# Altium schematic sheet POWER_GATEWAY.SchDoc
size A4
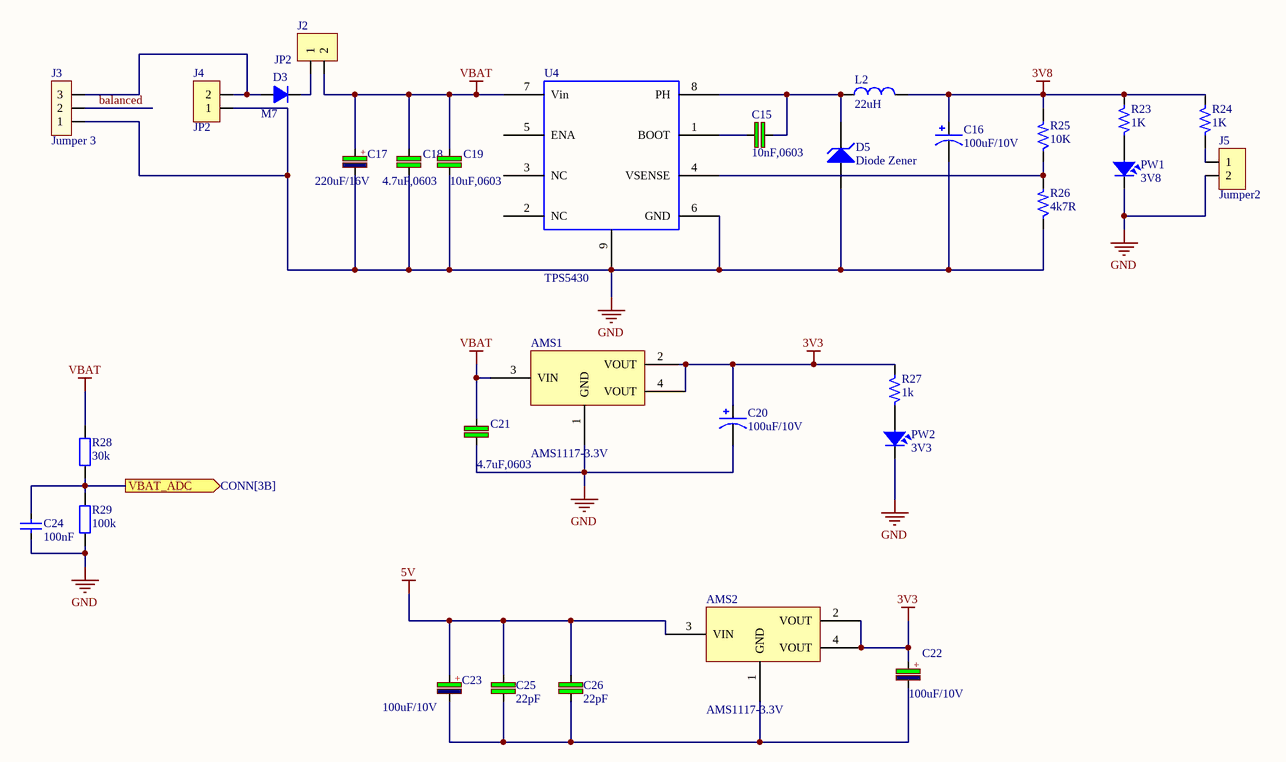
[diagram p0: POWER_GATEWAY.SchDoc]

## Parts
AMS1  AMS1117-3.3V  [SOT223]
AMS2  AMS1117-3.3V  [SOT223]
C15  value 10nF,0603  [CAP_0603]  (hidden comment: 100nF)
C16  100uF/10V  [CAP-ALU-SMD-C]
C17  220uF/16V  [CAP-ALU-SMD-D]
C18  value 4.7uF,0603  [CAP_0603]  (hidden comment: 100nF)
C19  value 10uF,0603  [CAP_0603]  (hidden comment: 100uF)
C20  100uF/10V  [CAP-ALU-SMD-C]
C21  value 4.7uF,0603  [CAP_0603]  (hidden comment: 33pF)
C22  100uF/10V  [CAP-ALU-SMD-C]
C23  100uF/10V  [CAP-ALU-SMD-C]
C24  100nF  [CAP_0805]
C25  22pF  [CAP_0603]
C26  22pF  [CAP_0603]
D3  M7  [SMA]
D5  Diode Zener  [SMA]
J2  JP2  [KF2-5.08]
J3  Jumper 3  [KF3-5.08]
J4  JP2  [KF2-5.08]
J5  Jumper2  [CON2]
L2  22uH  [L-SMD-M-7.3x4.5]
PW1  3V8  [LED-0805-Blue]
PW2  3V3  [LED-0805-Blue]
R23  1K  [RES-SMD-0805]
R24  1K  [RES-SMD-0805]
R25  10K  [RES-SMD-0603]
R26  4k7R  [RES-SMD-0603]
R27  1k  [RES-SMD-0603]
R28  30k  [RES-SMD-0805]
R29  100k  [RES-SMD-0805]
U4  TPS5430  [TPS5430-2]

## Ports
VBAT_ADC (out, see CONN[3B])

## Nets
3V3: AMS1.2(VOUT) AMS1.4(VOUT) AMS2.2(VOUT) AMS2.4(VOUT) C20.1 C22.1 R27.1
3V8: C16.1 L2.2 R23.1 R24.1 R25.2
5V: AMS2.3(VIN) C23.1 C25.1 C26.1
GND: AMS1.1(GND) C16.2 C17.2 C18.1 C19.1 C20.2 C21.1 C24.1 D5.1(A) J3.1 J4.1 J5.2 PW1.2 PW2.2 R26.1 R29.1 U4.6(GND) U4.9(PWR_PAD)
VBAT: AMS1.3(VIN) C17.1 C18.2 C19.2 C21.2 J2.2 R28.2 U4.7(Vin)
balanced: J3.2
VBAT_ADC: C24.2 R28.1 R29.2 ; port VBAT_ADC
NetAMS2_1: AMS2.1(GND) C22.2 C23.2 C25.2 C26.2
NetC15_1: C15.1 D5.2(K) L2.1 U4.8(PH)
NetC15_2: C15.2 U4.1(BOOT)
NetD3_1: D3.1(A) J3.3 J4.2
NetD3_2: D3.2(K) J2.1
NetJ5_1: J5.1 R24.2
NetPW1_1: PW1.1 R23.2
NetPW2_1: PW2.1 R27.2
NetR25_1: R25.1 R26.2 U4.4(VSENSE)

Not connected (* = marked no-connect by the designer): U4 2(NC) 3(NC) 5(ENA)

## Notes on the sheet
- (in symbol CP3) +

## Library data of the parts
AMS1 AMS2 = AMS1117 SMD: Dán; Value: AMS1117-3.3V SOT223; Don_Vi: Con; Ma_Hang: MH000596; Ghi_Chu: *; Kieu_Chan: *; Chung_Loai: Dán
C15 C18 C19 C21 = C: 4.7µF ±10% 35V Ceramic Capacitor X5R 0805 (2012 Metric); Manufacturer: Samsung Electro-Mechanics; Part number: CL21A475KLCLQNC; User_Description: CAP CER 4.7UF 35V X5R 0805; Category: CAPACITOR; Package: 0805
C16 C20 = Cap Pol: Polarized Capacitor (Axial); Published: 8-Jun-2000; LatestRevisionDate: 17-Jul-2002; LatestRevisionNote: Re-released for DXP Platform.; PackageReference: POLAR0.8; Publisher: Altium Limited
C17 C22 C23 = CP3: Cap 470uF/63V; Value: Cap 470uF/63V
C24 = CapSMD: Capacitor; Value: 33p; Published: 8-Jun-2000; LatestRevisionDate: 17-Jul-2002; LatestRevisionNote: Re-released for DXP Platform.; PackageReference: RAD-0.3; Publisher: Altium Limited
C25 C26 = C: Cap SMD; Manufacturer: Samsung Electro-Mechanics; Part number: CL21A106KPFNNNG; Value: 10uF; User_Description: CAP CER 10UF 10V X5R 0805; Category: CAPACITOR; Package: 0805
D3 = D1A: Diode 1A; Value: 1N4007
D5 = Diode Zener: Zener Diode; Published: 8-Jun-2000; LatestRevisionDate: 17-Jul-2002; LatestRevisionNote: Re-released for DXP Platform.; PackageReference: DIODE-0.7; Publisher: Altium Limited
J2 J4 J5 = JP2: WR-PHD 2.54 mm Angled Socket Header; Manufacturer: W¨¹rth Elektronik eiSos GmbH; partNo: 613002143121; ComponentLink1 Description: Manufacturer; ComponentLink2 Description: Datasheet; NoPins: 02; Created Date: 29 March 2013; ComponentLink1URL: http://www.we-online.com; ComponentLink2URL: http://katalog.we-online.de/em/datasheet/6130xx143121.pdf; Created by: Karrer Zheng
J3 = JP3: Value: J3
L2 = L1: 22µH Shielded Inductor 1.65A 96mOhm Max Nonstandard; Manufacturer: Bourns Inc.; Part Number: SRR0745A-220M; Value: 220uH; User_Description: FIXED IND 22UH 1.65A 96 MOHM SMD; Category: INDUCTORS; Package: SMD
PW1 PW2 = LED: LED RED DIFFUSED 0805 SMD; Manufacturer: OSRAM Opto Semiconductors Inc.; Part number: LS R976-NR-1; Value: Red; Category: LED SMD; Package: 0805; User_Description: LED RED DIFFUSED 0805 SMD
R23 R24 R27 = R: Resistor 1/4W; Manufacturer: Yageo; Part number: RC0805FR-071KL; User_Description: RES SMD 1K OHM 1% 1/8W 0805; Value: 1k; Category: RESISTORS; Package: 0805
R25 = R: RES SMD 10K OHM 1% 1/8W 0805; Manufacturer: Yageo; Part number: RC0805FR-0710KL; Category: RESISTORS; Package: 0805; User_Description: RES SMD 10K OHM 1% 1/8W 0805; Value: 10k
R26 = R: RES SMD 3.3K OHM 1% 1/8W 0805; Manufacturer: Yageo; Part number: RC0805FR-073K3L; Category: RESISTORS; Package: 0805; User_Description: RES SMD 3.3K OHM 1% 1/8W 0805; Value: 3.3k
R28 R29 = Resistor - SMD: Resistor SMD; Manufacturer: Generic Components; Class: Passive; Published: 08/06/2000; Publisher: Altium Hobart Technology Centre
U4 = TPS5430: Name: TPS5430